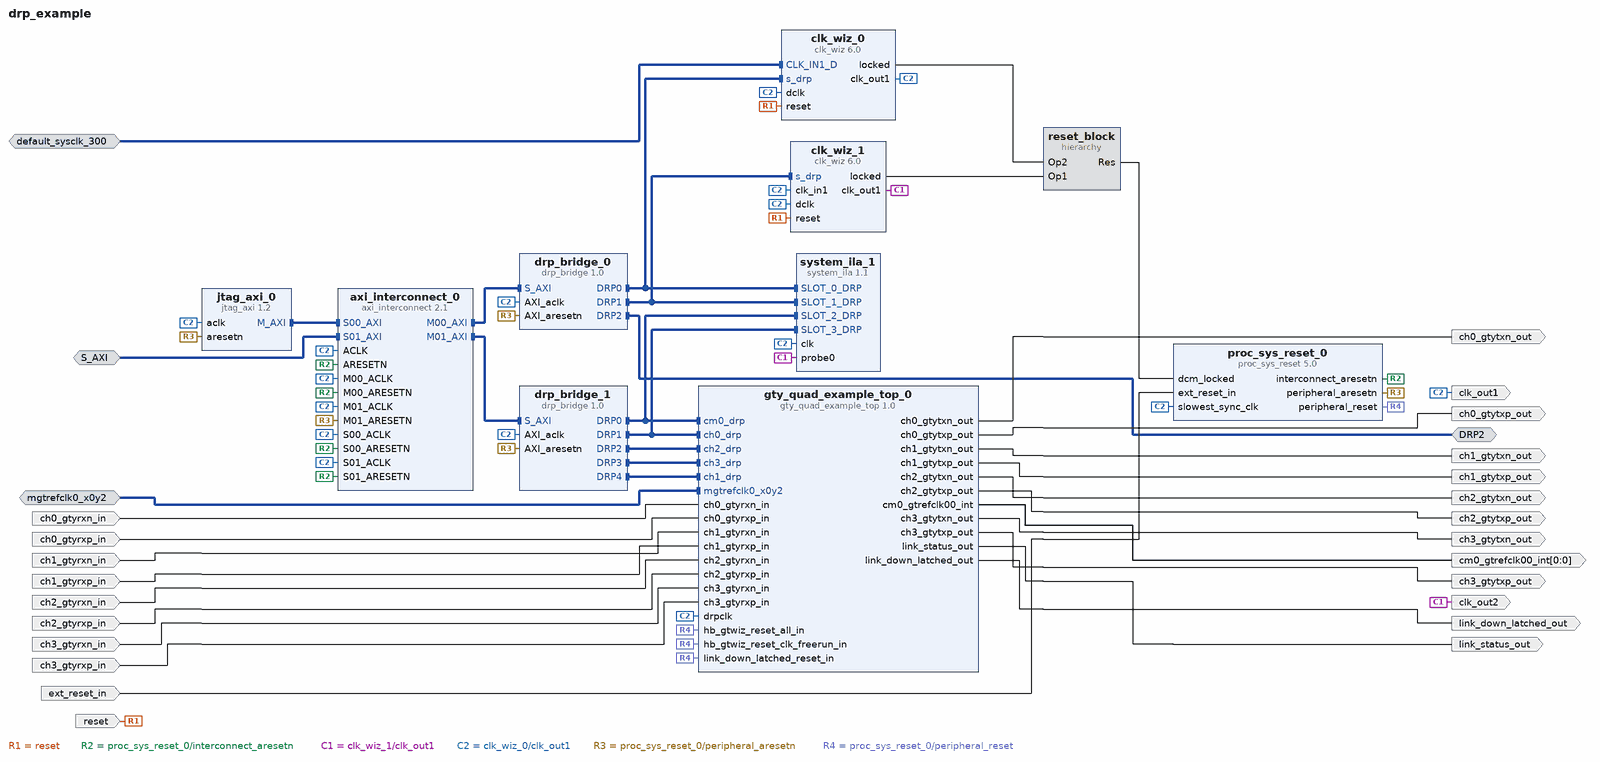
[diagram p0: block diagram of the top level]
# Vivado block design drp_example, xcku5p-ffvb676-2-e, Vivado 2018.1
create_bd_design drp_example

create_bd_intf_port -mode Master -vlnv xilinx.com:interface:drp_rtl:1.0 DRP2
create_bd_intf_port -mode Slave -vlnv xilinx.com:interface:aximm_rtl:1.0 S_AXI
set_property -dict [list \
  CONFIG.DATA_WIDTH 32 \
  CONFIG.PROTOCOL AXI4LITE \
  CONFIG.ID_WIDTH 0 \
  CONFIG.ADDR_WIDTH 31 \
  CONFIG.AWUSER_WIDTH 0 \
  CONFIG.ARUSER_WIDTH 0 \
  CONFIG.WUSER_WIDTH 0 \
  CONFIG.RUSER_WIDTH 0 \
  CONFIG.BUSER_WIDTH 0 \
  CONFIG.READ_WRITE_MODE READ_WRITE \
  CONFIG.HAS_BURST 1 \
  CONFIG.HAS_LOCK 1 \
  CONFIG.HAS_PROT 1 \
  CONFIG.HAS_CACHE 1 \
  CONFIG.HAS_QOS 1 \
  CONFIG.HAS_REGION 1 \
  CONFIG.HAS_WSTRB 1 \
  CONFIG.HAS_BRESP 1 \
  CONFIG.HAS_RRESP 1 \
  CONFIG.SUPPORTS_NARROW_BURST 0 \
  CONFIG.NUM_READ_OUTSTANDING 1 \
  CONFIG.NUM_WRITE_OUTSTANDING 1 \
  CONFIG.MAX_BURST_LENGTH 1 \
  CONFIG.NUM_READ_THREADS 1 \
  CONFIG.NUM_WRITE_THREADS 1 \
  CONFIG.RUSER_BITS_PER_BYTE 0 \
  CONFIG.WUSER_BITS_PER_BYTE 0 \
] [get_bd_intf_ports S_AXI]
create_bd_intf_port -mode Slave -vlnv xilinx.com:interface:diff_clock_rtl:1.0 default_sysclk_300
set_property -dict {CONFIG.FREQ_HZ 300000000} [get_bd_intf_ports default_sysclk_300]
create_bd_intf_port -mode Slave -vlnv xilinx.com:interface:diff_clock_rtl:1.0 mgtrefclk0_x0y2
create_bd_port -dir I -type rst reset
set_property -dict {CONFIG.POLARITY ACTIVE_HIGH} [get_bd_ports reset]
create_bd_port -dir O -type clk clk_out2
create_bd_port -dir O -from 0 -to 0 -type clk cm0_gtrefclk00_int
create_bd_port -dir O ch0_gtytxn_out
create_bd_port -dir O ch0_gtytxp_out
create_bd_port -dir O ch1_gtytxn_out
create_bd_port -dir O ch1_gtytxp_out
create_bd_port -dir O ch2_gtytxn_out
create_bd_port -dir O ch2_gtytxp_out
create_bd_port -dir O ch3_gtytxn_out
create_bd_port -dir O ch3_gtytxp_out
create_bd_port -dir O link_status_out
create_bd_port -dir O link_down_latched_out
create_bd_port -dir I ch0_gtyrxn_in
create_bd_port -dir I ch0_gtyrxp_in
create_bd_port -dir I ch1_gtyrxn_in
create_bd_port -dir I ch1_gtyrxp_in
create_bd_port -dir I ch2_gtyrxn_in
create_bd_port -dir I ch2_gtyrxp_in
create_bd_port -dir I ch3_gtyrxn_in
create_bd_port -dir I ch3_gtyrxp_in
create_bd_port -dir O -type clk clk_out1
set_property -dict {CONFIG.ASSOCIATED_BUSIF S_AXI} [get_bd_ports clk_out1]
create_bd_port -dir I -type rst ext_reset_in
set_property -dict {CONFIG.POLARITY ACTIVE_HIGH} [get_bd_ports ext_reset_in]

create_bd_cell -type hier reset_block
create_bd_cell -type ip -vlnv xilinx.com:ip:axi_interconnect:2.1 axi_interconnect_0
set_property -dict {CONFIG.NUM_SI 2 CONFIG.NUM_MI 2} [get_bd_cells axi_interconnect_0]
create_bd_cell -type ip -vlnv xilinx.com:ip:clk_wiz:6.0 clk_wiz_0
set_property -dict [list \
  CONFIG.USE_PHASE_ALIGNMENT true \
  CONFIG.USE_DYN_RECONFIG true \
  CONFIG.SECONDARY_SOURCE Single_ended_clock_capable_pin \
  CONFIG.CLKIN1_JITTER_PS 33.330000000000005 \
  CONFIG.PRIM_SOURCE Differential_clock_capable_pin \
  CONFIG.CLKOUT1_DRIVES Buffer \
  CONFIG.CLKOUT2_DRIVES Buffer \
  CONFIG.CLKOUT3_DRIVES Buffer \
  CONFIG.CLKOUT4_DRIVES Buffer \
  CONFIG.CLKOUT5_DRIVES Buffer \
  CONFIG.CLKOUT6_DRIVES Buffer \
  CONFIG.CLKOUT7_DRIVES Buffer \
  CONFIG.MMCM_DIVCLK_DIVIDE 1 \
  CONFIG.MMCM_CLKFBOUT_MULT_F 4.000 \
  CONFIG.MMCM_CLKIN1_PERIOD 3.333 \
  CONFIG.MMCM_CLKIN2_PERIOD 10.0 \
  CONFIG.USE_BOARD_FLOW true \
  CONFIG.CLK_IN1_BOARD_INTERFACE default_sysclk1_300 \
  CONFIG.RESET_BOARD_INTERFACE reset \
  CONFIG.CLKOUT1_JITTER 101.475 \
  CONFIG.CLKOUT1_PHASE_ERROR 77.836 \
  CONFIG.INTERFACE_SELECTION Enable_DRP \
  CONFIG.AXI_DRP false \
  CONFIG.PHASE_DUTY_CONFIG false \
] [get_bd_cells clk_wiz_0]
create_bd_cell -type ip -vlnv xilinx.com:ip:clk_wiz:6.0 clk_wiz_1
set_property -dict [list \
  CONFIG.PRIMITIVE PLL \
  CONFIG.USE_DYN_RECONFIG true \
  CONFIG.CLKOUT1_DRIVES BUFG \
  CONFIG.CLKOUT2_DRIVES Buffer \
  CONFIG.CLKOUT3_DRIVES Buffer \
  CONFIG.CLKOUT4_DRIVES Buffer \
  CONFIG.CLKOUT5_DRIVES Buffer \
  CONFIG.CLKOUT6_DRIVES Buffer \
  CONFIG.CLKOUT7_DRIVES Buffer \
  CONFIG.FEEDBACK_SOURCE FDBK_AUTO \
  CONFIG.MMCM_DIVCLK_DIVIDE 1 \
  CONFIG.MMCM_CLKFBOUT_MULT_F 8 \
  CONFIG.MMCM_COMPENSATION AUTO \
  CONFIG.MMCM_CLKOUT0_DIVIDE_F 8 \
  CONFIG.USE_BOARD_FLOW true \
  CONFIG.RESET_BOARD_INTERFACE reset \
  CONFIG.CLKOUT1_JITTER 144.719 \
  CONFIG.CLKOUT1_PHASE_ERROR 114.212 \
  CONFIG.INTERFACE_SELECTION Enable_DRP \
  CONFIG.AXI_DRP false \
  CONFIG.PHASE_DUTY_CONFIG false \
] [get_bd_cells clk_wiz_1]
create_bd_cell -type ip -vlnv xilinx.com:user:drp_bridge:1.0 drp_bridge_0
set_property -dict {CONFIG.DRP_ADDR_WIDTH 7 CONFIG.DRP_COUNT 3} [get_bd_cells drp_bridge_0]
create_bd_cell -type ip -vlnv xilinx.com:ip:system_ila:1.1 system_ila_1
set_property -dict [list \
  CONFIG.C_SLOT_3_TYPE 0 \
  CONFIG.C_SLOT_2_TYPE 0 \
  CONFIG.C_SLOT_1_TYPE 0 \
  CONFIG.C_SLOT_0_TYPE 0 \
  CONFIG.C_PROBE0_TYPE 0 \
  CONFIG.C_NUM_OF_PROBES 1 \
  CONFIG.C_NUM_MONITOR_SLOTS 4 \
  CONFIG.C_SLOT_0_INTF_TYPE xilinx.com:interface:drp_rtl:1.0 \
  CONFIG.C_SLOT_1_INTF_TYPE xilinx.com:interface:drp_rtl:1.0 \
  CONFIG.C_SLOT_2_INTF_TYPE xilinx.com:interface:drp_rtl:1.0 \
  CONFIG.C_SLOT_3_INTF_TYPE xilinx.com:interface:drp_rtl:1.0 \
  CONFIG.C_MON_TYPE MIX \
] [get_bd_cells system_ila_1]
create_bd_cell -type ip -vlnv xilinx.com:user:drp_bridge:1.0 drp_bridge_1
set_property -dict {CONFIG.DRP_ADDR_WIDTH 10 CONFIG.DRP_COUNT 5} [get_bd_cells drp_bridge_1]
create_bd_cell -type ip -vlnv xilinx.com:ip:jtag_axi:1.2 jtag_axi_0
create_bd_cell -type ip -vlnv xilinx.com:ip:proc_sys_reset:5.0 proc_sys_reset_0
set_property -dict {CONFIG.C_AUX_RESET_HIGH 0} [get_bd_cells proc_sys_reset_0]
create_bd_cell -type ip -vlnv user.org:user:gty_quad_example_top:1.0 gty_quad_example_top_0

# ---- hierarchy /reset_block ----
current_bd_instance /reset_block
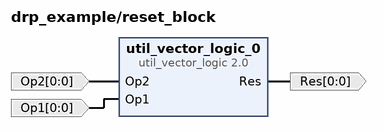
[diagram p1: block diagram inside /reset_block]
create_bd_pin -dir I -from 0 -to 0 Op1
create_bd_pin -dir I -from 0 -to 0 Op2
create_bd_pin -dir O -from 0 -to 0 Res

create_bd_cell -type ip -vlnv xilinx.com:ip:util_vector_logic:2.0 util_vector_logic_0
set_property -dict {CONFIG.C_SIZE 1} [get_bd_cells util_vector_logic_0]

# ---- connections ----

current_bd_instance /reset_block
connect_bd_net -net clk_wiz_0_locked [get_bd_pins Op2] [get_bd_pins util_vector_logic_0/Op2]
connect_bd_net -net clk_wiz_1_locked [get_bd_pins Op1] [get_bd_pins util_vector_logic_0/Op1]
connect_bd_net [get_bd_pins util_vector_logic_0/Res] [get_bd_pins Res]

current_bd_instance /
connect_bd_intf_net [get_bd_intf_pins axi_interconnect_0/M00_AXI] [get_bd_intf_pins drp_bridge_0/S_AXI]
connect_bd_intf_net [get_bd_intf_pins clk_wiz_0/s_drp] [get_bd_intf_pins drp_bridge_0/DRP0]
connect_bd_intf_net [get_bd_intf_pins clk_wiz_0/s_drp] [get_bd_intf_pins system_ila_1/SLOT_0_DRP]
connect_bd_intf_net [get_bd_intf_pins drp_bridge_0/DRP1] [get_bd_intf_pins clk_wiz_1/s_drp]
connect_bd_intf_net [get_bd_intf_pins drp_bridge_0/DRP1] [get_bd_intf_pins system_ila_1/SLOT_1_DRP]
connect_bd_intf_net [get_bd_intf_pins axi_interconnect_0/M01_AXI] [get_bd_intf_pins drp_bridge_1/S_AXI]
connect_bd_intf_net [get_bd_intf_pins drp_bridge_1/DRP0] [get_bd_intf_pins gty_quad_example_top_0/cm0_drp]
connect_bd_intf_net [get_bd_intf_pins drp_bridge_1/DRP0] [get_bd_intf_pins system_ila_1/SLOT_2_DRP]
connect_bd_intf_net [get_bd_intf_pins drp_bridge_1/DRP1] [get_bd_intf_pins gty_quad_example_top_0/ch0_drp]
connect_bd_intf_net [get_bd_intf_pins drp_bridge_1/DRP1] [get_bd_intf_pins system_ila_1/SLOT_3_DRP]
connect_bd_intf_net [get_bd_intf_pins drp_bridge_1/DRP2] [get_bd_intf_pins gty_quad_example_top_0/ch2_drp]
connect_bd_intf_net [get_bd_intf_pins drp_bridge_1/DRP3] [get_bd_intf_pins gty_quad_example_top_0/ch3_drp]
connect_bd_intf_net [get_bd_intf_pins drp_bridge_1/DRP4] [get_bd_intf_pins gty_quad_example_top_0/ch1_drp]
connect_bd_intf_net [get_bd_intf_pins jtag_axi_0/M_AXI] [get_bd_intf_pins axi_interconnect_0/S00_AXI]
connect_bd_intf_net [get_bd_intf_ports DRP2] [get_bd_intf_pins drp_bridge_0/DRP2]
connect_bd_intf_net [get_bd_intf_ports S_AXI] [get_bd_intf_pins axi_interconnect_0/S01_AXI]
connect_bd_intf_net -intf_net default_sysclk1_300_1 [get_bd_intf_ports default_sysclk_300] [get_bd_intf_pins clk_wiz_0/CLK_IN1_D]
connect_bd_intf_net -intf_net mgtrefclk0_x0y2_1 [get_bd_intf_ports mgtrefclk0_x0y2] [get_bd_intf_pins gty_quad_example_top_0/mgtrefclk0_x0y2]
connect_bd_net [get_bd_pins clk_wiz_0/locked] [get_bd_pins reset_block/Op2]
connect_bd_net [get_bd_ports reset] [get_bd_pins clk_wiz_0/reset] [get_bd_pins clk_wiz_1/reset]
connect_bd_net -net ARESETN_1 [get_bd_pins proc_sys_reset_0/interconnect_aresetn] \
  [get_bd_pins axi_interconnect_0/ARESETN] [get_bd_pins axi_interconnect_0/S01_ARESETN] \
  [get_bd_pins axi_interconnect_0/M00_ARESETN] [get_bd_pins axi_interconnect_0/S00_ARESETN]
connect_bd_net [get_bd_pins clk_wiz_1/locked] [get_bd_pins reset_block/Op1]
connect_bd_net [get_bd_pins clk_wiz_1/clk_out1] [get_bd_ports clk_out2] [get_bd_pins system_ila_1/probe0]
connect_bd_net [get_bd_pins gty_quad_example_top_0/cm0_gtrefclk00_int] [get_bd_ports cm0_gtrefclk00_int]
connect_bd_net [get_bd_pins gty_quad_example_top_0/ch0_gtytxn_out] [get_bd_ports ch0_gtytxn_out]
connect_bd_net [get_bd_pins gty_quad_example_top_0/ch0_gtytxp_out] [get_bd_ports ch0_gtytxp_out]
connect_bd_net [get_bd_pins gty_quad_example_top_0/ch1_gtytxn_out] [get_bd_ports ch1_gtytxn_out]
connect_bd_net [get_bd_pins gty_quad_example_top_0/ch1_gtytxp_out] [get_bd_ports ch1_gtytxp_out]
connect_bd_net [get_bd_pins gty_quad_example_top_0/ch2_gtytxn_out] [get_bd_ports ch2_gtytxn_out]
connect_bd_net [get_bd_pins gty_quad_example_top_0/ch2_gtytxp_out] [get_bd_ports ch2_gtytxp_out]
connect_bd_net [get_bd_pins gty_quad_example_top_0/ch3_gtytxn_out] [get_bd_ports ch3_gtytxn_out]
connect_bd_net [get_bd_pins gty_quad_example_top_0/ch3_gtytxp_out] [get_bd_ports ch3_gtytxp_out]
connect_bd_net [get_bd_pins gty_quad_example_top_0/link_status_out] [get_bd_ports link_status_out]
connect_bd_net [get_bd_pins gty_quad_example_top_0/link_down_latched_out] [get_bd_ports link_down_latched_out]
connect_bd_net [get_bd_ports ch0_gtyrxn_in] [get_bd_pins gty_quad_example_top_0/ch0_gtyrxn_in]
connect_bd_net [get_bd_ports ch0_gtyrxp_in] [get_bd_pins gty_quad_example_top_0/ch0_gtyrxp_in]
connect_bd_net [get_bd_ports ch1_gtyrxn_in] [get_bd_pins gty_quad_example_top_0/ch1_gtyrxn_in]
connect_bd_net [get_bd_ports ch1_gtyrxp_in] [get_bd_pins gty_quad_example_top_0/ch1_gtyrxp_in]
connect_bd_net [get_bd_ports ch2_gtyrxn_in] [get_bd_pins gty_quad_example_top_0/ch2_gtyrxn_in]
connect_bd_net [get_bd_ports ch2_gtyrxp_in] [get_bd_pins gty_quad_example_top_0/ch2_gtyrxp_in]
connect_bd_net [get_bd_ports ch3_gtyrxn_in] [get_bd_pins gty_quad_example_top_0/ch3_gtyrxn_in]
connect_bd_net [get_bd_ports ch3_gtyrxp_in] [get_bd_pins gty_quad_example_top_0/ch3_gtyrxp_in]
connect_bd_net [get_bd_pins clk_wiz_0/clk_out1] \
  [get_bd_ports clk_out1] [get_bd_pins drp_bridge_0/AXI_aclk] [get_bd_pins clk_wiz_0/dclk] [get_bd_pins clk_wiz_1/dclk] \
  [get_bd_pins clk_wiz_1/clk_in1] [get_bd_pins system_ila_1/clk] [get_bd_pins drp_bridge_1/AXI_aclk] \
  [get_bd_pins jtag_axi_0/aclk] [get_bd_pins proc_sys_reset_0/slowest_sync_clk] [get_bd_pins axi_interconnect_0/ACLK] \
  [get_bd_pins axi_interconnect_0/S00_ACLK] [get_bd_pins axi_interconnect_0/M00_ACLK] \
  [get_bd_pins axi_interconnect_0/S01_ACLK] [get_bd_pins axi_interconnect_0/M01_ACLK] \
  [get_bd_pins gty_quad_example_top_0/drpclk]
connect_bd_net [get_bd_pins reset_block/Res] [get_bd_pins proc_sys_reset_0/dcm_locked]
connect_bd_net [get_bd_ports ext_reset_in] [get_bd_pins proc_sys_reset_0/ext_reset_in]
connect_bd_net -net reset_block_peripheral_aresetn [get_bd_pins proc_sys_reset_0/peripheral_aresetn] \
  [get_bd_pins drp_bridge_0/AXI_aresetn] [get_bd_pins drp_bridge_1/AXI_aresetn] [get_bd_pins jtag_axi_0/aresetn] \
  [get_bd_pins axi_interconnect_0/M01_ARESETN]
connect_bd_net [get_bd_pins proc_sys_reset_0/peripheral_reset] \
  [get_bd_pins gty_quad_example_top_0/hb_gtwiz_reset_clk_freerun_in] \
  [get_bd_pins gty_quad_example_top_0/hb_gtwiz_reset_all_in] [get_bd_pins gty_quad_example_top_0/link_down_latched_reset_in]

# ---- address map ----
assign_bd_address -offset 0x00000000 -range 256K -target_address_space [get_bd_addr_spaces jtag_axi_0/Data] [get_bd_addr_segs drp_bridge_1/S_AXI/reg0]
assign_bd_address -offset 0x44A10000 -range 4K -target_address_space [get_bd_addr_spaces jtag_axi_0/Data] [get_bd_addr_segs drp_bridge_0/S_AXI/reg0]
assign_bd_address -offset 0x00000000 -range 256K -target_address_space [get_bd_addr_spaces S_AXI] [get_bd_addr_segs drp_bridge_1/S_AXI/reg0]
assign_bd_address -offset 0x44A10000 -range 4K -target_address_space [get_bd_addr_spaces S_AXI] [get_bd_addr_segs drp_bridge_0/S_AXI/reg0]

validate_bd_design
save_bd_design
